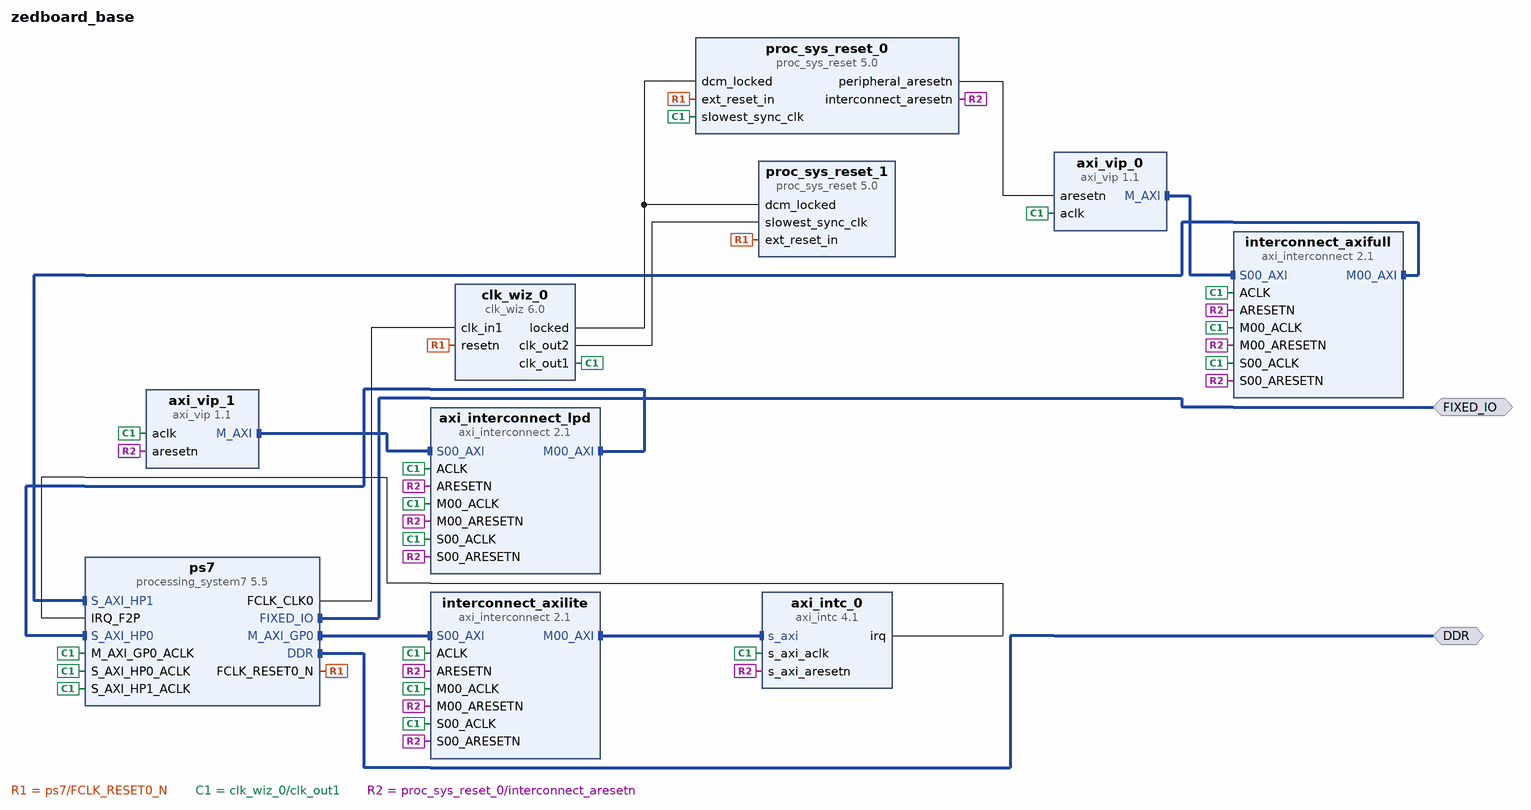
[diagram p0: block diagram of the top level]
# Vivado block design zedboard_base, xc7z020clg484-1, Vivado 2020.2
create_bd_design zedboard_base

create_bd_intf_port -mode Master -vlnv xilinx.com:interface:ddrx_rtl:1.0 DDR
create_bd_intf_port -mode Master -vlnv xilinx.com:display_processing_system7:fixedio_rtl:1.0 FIXED_IO

create_bd_cell -type ip -vlnv xilinx.com:ip:axi_intc:4.1 axi_intc_0
set_property -dict {CONFIG.C_ASYNC_INTR 0xFFFFFFFF CONFIG.C_IRQ_CONNECTION 1 CONFIG.C_IRQ_IS_LEVEL 1} [get_bd_cells axi_intc_0]
create_bd_cell -type ip -vlnv xilinx.com:ip:axi_interconnect:2.1 axi_interconnect_lpd
set_property -dict {CONFIG.NUM_MI 1} [get_bd_cells axi_interconnect_lpd]
create_bd_cell -type ip -vlnv xilinx.com:ip:axi_vip:1.1 axi_vip_0
set_property -dict [list \
  CONFIG.ADDR_WIDTH 32 \
  CONFIG.ARUSER_WIDTH 0 \
  CONFIG.AWUSER_WIDTH 0 \
  CONFIG.BUSER_WIDTH 0 \
  CONFIG.DATA_WIDTH 32 \
  CONFIG.HAS_BRESP 1 \
  CONFIG.HAS_BURST 1 \
  CONFIG.HAS_CACHE 1 \
  CONFIG.HAS_LOCK 1 \
  CONFIG.HAS_PROT 1 \
  CONFIG.HAS_QOS 1 \
  CONFIG.HAS_REGION 1 \
  CONFIG.HAS_RRESP 1 \
  CONFIG.HAS_WSTRB 1 \
  CONFIG.ID_WIDTH 0 \
  CONFIG.INTERFACE_MODE MASTER \
  CONFIG.PROTOCOL AXI4 \
  CONFIG.READ_WRITE_MODE READ_WRITE \
  CONFIG.RUSER_BITS_PER_BYTE 0 \
  CONFIG.RUSER_WIDTH 0 \
  CONFIG.SUPPORTS_NARROW 1 \
  CONFIG.WUSER_BITS_PER_BYTE 0 \
  CONFIG.WUSER_WIDTH 0 \
] [get_bd_cells axi_vip_0]
create_bd_cell -type ip -vlnv xilinx.com:ip:axi_vip:1.1 axi_vip_1
set_property -dict [list \
  CONFIG.ADDR_WIDTH 32 \
  CONFIG.ARUSER_WIDTH 0 \
  CONFIG.AWUSER_WIDTH 0 \
  CONFIG.BUSER_WIDTH 0 \
  CONFIG.DATA_WIDTH 32 \
  CONFIG.HAS_BRESP 1 \
  CONFIG.HAS_BURST 1 \
  CONFIG.HAS_CACHE 1 \
  CONFIG.HAS_LOCK 1 \
  CONFIG.HAS_PROT 1 \
  CONFIG.HAS_QOS 1 \
  CONFIG.HAS_REGION 1 \
  CONFIG.HAS_RRESP 1 \
  CONFIG.HAS_WSTRB 1 \
  CONFIG.ID_WIDTH 0 \
  CONFIG.INTERFACE_MODE MASTER \
  CONFIG.PROTOCOL AXI4 \
  CONFIG.READ_WRITE_MODE READ_WRITE \
  CONFIG.RUSER_BITS_PER_BYTE 0 \
  CONFIG.RUSER_WIDTH 0 \
  CONFIG.SUPPORTS_NARROW 1 \
  CONFIG.WUSER_BITS_PER_BYTE 0 \
  CONFIG.WUSER_WIDTH 0 \
] [get_bd_cells axi_vip_1]
create_bd_cell -type ip -vlnv xilinx.com:ip:clk_wiz:6.0 clk_wiz_0
set_property -dict [list \
  CONFIG.CLKOUT1_JITTER 144.067 \
  CONFIG.CLKOUT1_PHASE_ERROR 156.412 \
  CONFIG.CLKOUT1_REQUESTED_OUT_FREQ 100 \
  CONFIG.CLKOUT2_JITTER 136.006 \
  CONFIG.CLKOUT2_PHASE_ERROR 156.412 \
  CONFIG.CLKOUT2_REQUESTED_OUT_FREQ 142 \
  CONFIG.CLKOUT2_USED true \
  CONFIG.CLKOUT3_REQUESTED_OUT_FREQ 100.000 \
  CONFIG.CLKOUT3_USED false \
  CONFIG.CLKOUT4_REQUESTED_OUT_FREQ 100.000 \
  CONFIG.CLKOUT4_USED false \
  CONFIG.CLKOUT5_REQUESTED_OUT_FREQ 100.000 \
  CONFIG.CLKOUT5_USED false \
  CONFIG.CLKOUT6_REQUESTED_OUT_FREQ 100.000 \
  CONFIG.CLKOUT6_USED false \
  CONFIG.MMCM_CLKFBOUT_MULT_F 11.375 \
  CONFIG.MMCM_CLKOUT0_DIVIDE_F 11.375 \
  CONFIG.MMCM_CLKOUT1_DIVIDE 8 \
  CONFIG.MMCM_CLKOUT2_DIVIDE 1 \
  CONFIG.MMCM_CLKOUT3_DIVIDE 1 \
  CONFIG.MMCM_CLKOUT4_DIVIDE 1 \
  CONFIG.MMCM_CLKOUT5_DIVIDE 1 \
  CONFIG.NUM_OUT_CLKS 2 \
  CONFIG.RESET_TYPE ACTIVE_LOW \
] [get_bd_cells clk_wiz_0]
create_bd_cell -type ip -vlnv xilinx.com:ip:axi_interconnect:2.1 interconnect_axifull
set_property -dict {CONFIG.NUM_MI 1} [get_bd_cells interconnect_axifull]
create_bd_cell -type ip -vlnv xilinx.com:ip:axi_interconnect:2.1 interconnect_axilite
set_property -dict {CONFIG.NUM_MI 1} [get_bd_cells interconnect_axilite]
create_bd_cell -type ip -vlnv xilinx.com:ip:proc_sys_reset:5.0 proc_sys_reset_0
create_bd_cell -type ip -vlnv xilinx.com:ip:proc_sys_reset:5.0 proc_sys_reset_1
create_bd_cell -type ip -vlnv xilinx.com:ip:processing_system7:5.5 ps7
set_property -dict [list \
  CONFIG.PCW_APU_PERIPHERAL_FREQMHZ 666.666667 \
  CONFIG.PCW_ENET0_ENET0_IO {MIO 16 .. 27} \
  CONFIG.PCW_ENET0_GRP_MDIO_ENABLE 1 \
  CONFIG.PCW_ENET0_GRP_MDIO_IO {MIO 52 .. 53} \
  CONFIG.PCW_ENET0_PERIPHERAL_ENABLE 1 \
  CONFIG.PCW_ENET0_RESET_ENABLE 0 \
  CONFIG.PCW_ENET_RESET_ENABLE 1 \
  CONFIG.PCW_ENET_RESET_SELECT {Share reset pin} \
  CONFIG.PCW_FPGA0_PERIPHERAL_FREQMHZ 100.000000 \
  CONFIG.PCW_FPGA1_PERIPHERAL_FREQMHZ 150.000000 \
  CONFIG.PCW_FPGA2_PERIPHERAL_FREQMHZ 50.000000 \
  CONFIG.PCW_GPIO_MIO_GPIO_ENABLE 1 \
  CONFIG.PCW_GPIO_MIO_GPIO_IO MIO \
  CONFIG.PCW_I2C_RESET_ENABLE 1 \
  CONFIG.PCW_IRQ_F2P_INTR 1 \
  CONFIG.PCW_PRESET_BANK1_VOLTAGE {LVCMOS 1.8V} \
  CONFIG.PCW_QSPI_GRP_SINGLE_SS_ENABLE 1 \
  CONFIG.PCW_QSPI_GRP_SINGLE_SS_IO {MIO 1 .. 6} \
  CONFIG.PCW_QSPI_PERIPHERAL_ENABLE 1 \
  CONFIG.PCW_QSPI_PERIPHERAL_FREQMHZ 200.000000 \
  CONFIG.PCW_QSPI_QSPI_IO {MIO 1 .. 6} \
  CONFIG.PCW_SD0_GRP_CD_ENABLE 1 \
  CONFIG.PCW_SD0_GRP_CD_IO {MIO 47} \
  CONFIG.PCW_SD0_GRP_WP_ENABLE 1 \
  CONFIG.PCW_SD0_GRP_WP_IO {MIO 46} \
  CONFIG.PCW_SD0_PERIPHERAL_ENABLE 1 \
  CONFIG.PCW_SD0_SD0_IO {MIO 40 .. 45} \
  CONFIG.PCW_SDIO_PERIPHERAL_FREQMHZ 50 \
  CONFIG.PCW_SINGLE_QSPI_DATA_MODE x4 \
  CONFIG.PCW_TTC0_PERIPHERAL_ENABLE 1 \
  CONFIG.PCW_TTC0_TTC0_IO EMIO \
  CONFIG.PCW_UART1_PERIPHERAL_ENABLE 1 \
  CONFIG.PCW_UART1_UART1_IO {MIO 48 .. 49} \
  CONFIG.PCW_UART_PERIPHERAL_FREQMHZ 50 \
  CONFIG.PCW_UIPARAM_DDR_FREQ_MHZ 533.333313 \
  CONFIG.PCW_UIPARAM_DDR_PARTNO {MT41J128M16 HA-15E} \
  CONFIG.PCW_USB0_PERIPHERAL_ENABLE 1 \
  CONFIG.PCW_USB0_RESET_ENABLE 0 \
  CONFIG.PCW_USB0_USB0_IO {MIO 28 .. 39} \
  CONFIG.PCW_USB_RESET_ENABLE 1 \
  CONFIG.PCW_USB_RESET_SELECT {Share reset pin} \
  CONFIG.PCW_USE_FABRIC_INTERRUPT 1 \
  CONFIG.PCW_USE_S_AXI_HP0 1 \
  CONFIG.PCW_USE_S_AXI_HP1 1 \
  CONFIG.preset ZedBoard \
] [get_bd_cells ps7]
# 222 more settings of ps7 are not shown: defaults, MIO pin electricals, DDR timing, and values the tool derives

# ---- connections ----

connect_bd_intf_net [get_bd_intf_ports FIXED_IO] [get_bd_intf_pins ps7/FIXED_IO]
connect_bd_intf_net [get_bd_intf_ports DDR] [get_bd_intf_pins ps7/DDR]
connect_bd_intf_net [get_bd_intf_pins axi_vip_0/M_AXI] [get_bd_intf_pins interconnect_axifull/S00_AXI]
connect_bd_intf_net -intf_net ps_7_M_AXI_HPM0_LPD [get_bd_intf_pins interconnect_axilite/S00_AXI] [get_bd_intf_pins ps7/M_AXI_GP0]
connect_bd_intf_net -intf_net axi_interconnect_0_M00_AXI [get_bd_intf_pins axi_intc_0/s_axi] [get_bd_intf_pins interconnect_axilite/M00_AXI]
connect_bd_intf_net [get_bd_intf_pins axi_interconnect_lpd/S00_AXI] [get_bd_intf_pins axi_vip_1/M_AXI]
connect_bd_intf_net -intf_net axi_interconnect_0_M00_AXI1 [get_bd_intf_pins axi_interconnect_lpd/M00_AXI] [get_bd_intf_pins ps7/S_AXI_HP0]
connect_bd_intf_net -intf_net axi_interconnect_1_M00_AXI [get_bd_intf_pins interconnect_axifull/M00_AXI] [get_bd_intf_pins ps7/S_AXI_HP1]
connect_bd_net [get_bd_pins ps7/FCLK_RESET0_N] \
  [get_bd_pins clk_wiz_0/resetn] [get_bd_pins proc_sys_reset_0/ext_reset_in] [get_bd_pins proc_sys_reset_1/ext_reset_in]
connect_bd_net [get_bd_pins axi_intc_0/irq] [get_bd_pins ps7/IRQ_F2P]
connect_bd_net -net ACLK_1 [get_bd_pins clk_wiz_0/clk_out1] \
  [get_bd_pins axi_interconnect_lpd/ACLK] [get_bd_pins axi_interconnect_lpd/M00_ACLK] \
  [get_bd_pins axi_interconnect_lpd/S00_ACLK] [get_bd_pins axi_vip_0/aclk] [get_bd_pins axi_vip_1/aclk] \
  [get_bd_pins interconnect_axifull/ACLK] [get_bd_pins interconnect_axifull/M00_ACLK] \
  [get_bd_pins interconnect_axifull/S00_ACLK] [get_bd_pins axi_intc_0/s_axi_aclk] [get_bd_pins interconnect_axilite/ACLK] \
  [get_bd_pins interconnect_axilite/M00_ACLK] [get_bd_pins interconnect_axilite/S00_ACLK] [get_bd_pins ps7/S_AXI_HP0_ACLK] \
  [get_bd_pins proc_sys_reset_0/slowest_sync_clk] [get_bd_pins ps7/M_AXI_GP0_ACLK] [get_bd_pins ps7/S_AXI_HP1_ACLK]
connect_bd_net [get_bd_pins clk_wiz_0/clk_out2] [get_bd_pins proc_sys_reset_1/slowest_sync_clk]
connect_bd_net [get_bd_pins clk_wiz_0/locked] [get_bd_pins proc_sys_reset_0/dcm_locked] [get_bd_pins proc_sys_reset_1/dcm_locked]
connect_bd_net [get_bd_pins proc_sys_reset_0/interconnect_aresetn] \
  [get_bd_pins axi_interconnect_lpd/ARESETN] [get_bd_pins axi_interconnect_lpd/M00_ARESETN] \
  [get_bd_pins axi_interconnect_lpd/S00_ARESETN] [get_bd_pins axi_vip_1/aresetn] [get_bd_pins interconnect_axifull/ARESETN] \
  [get_bd_pins interconnect_axifull/M00_ARESETN] [get_bd_pins interconnect_axifull/S00_ARESETN] \
  [get_bd_pins axi_intc_0/s_axi_aresetn] [get_bd_pins interconnect_axilite/ARESETN] \
  [get_bd_pins interconnect_axilite/M00_ARESETN] [get_bd_pins interconnect_axilite/S00_ARESETN]
connect_bd_net [get_bd_pins proc_sys_reset_0/peripheral_aresetn] [get_bd_pins axi_vip_0/aresetn]
connect_bd_net -net ps_7_pl_clk0 [get_bd_pins ps7/FCLK_CLK0] [get_bd_pins clk_wiz_0/clk_in1]
set_property PFM.IRQ {intr {id 0 range 32}} [get_bd_cells axi_intc_0]
set_property PFM.AXI_PORT {S01_AXI {memport "S_AXI_HP" sptag "" memory ""} S02_AXI {memport "S_AXI_HP" sptag "" memory ""} S03_AXI {memport "S_AXI_HP" sptag "" memory ""} S04_AXI {memport "S_AXI_HP" sptag "" memory ""} S05_AXI {memport "S_AXI_HP" sptag "" memory ""} S06_AXI {memport "S_AXI_HP" sptag "" memory ""} S07_AXI {memport "S_AXI_HP" sptag "" memory ""} S08_AXI {memport "S_AXI_HP" sptag "" memory ""} S09_AXI {memport "S_AXI_HP" sptag "" memory ""} S10_AXI {memport "S_AXI_HP" sptag "" memory ""} S11_AXI {memport "S_AXI_HP" sptag "" memory ""} S12_AXI {memport "S_AXI_HP" sptag "" memory ""} S13_AXI {memport "S_AXI_HP" sptag "" memory ""} S14_AXI {memport "S_AXI_HP" sptag "" memory ""} S15_AXI {memport "S_AXI_HP" sptag "" memory ""}} [get_bd_cells axi_interconnect_lpd]
set_property PFM.CLOCK {clk_out1 {id "0" is_default "true" proc_sys_reset "proc_sys_reset_0" status "fixed"} clk_out2 {id "1" is_default "false" proc_sys_reset "proc_sys_reset_1" status "fixed"}} [get_bd_cells clk_wiz_0]
set_property HDL_ATTRIBUTE.DPA_TRACE_SLAVE true [get_bd_cells interconnect_axifull]
set_property PFM.AXI_PORT {S01_AXI {memport "S_AXI_HP" sptag "HP0" memory ""} S02_AXI {memport "S_AXI_HP" sptag "HP0" memory ""} S03_AXI {memport "S_AXI_HP" sptag "HP0" memory ""} S04_AXI {memport "S_AXI_HP" sptag "HP0" memory ""} S05_AXI {memport "S_AXI_HP" sptag "HP0" memory ""} S06_AXI {memport "S_AXI_HP" sptag "HP0" memory ""} S07_AXI {memport "S_AXI_HP" sptag "HP0" memory ""} S08_AXI {memport "S_AXI_HP" sptag "HP0" memory ""} S09_AXI {memport "S_AXI_HP" sptag "HP0" memory ""} S10_AXI {memport "S_AXI_HP" sptag "HP0" memory ""} S11_AXI {memport "S_AXI_HP" sptag "HP0" memory ""} S12_AXI {memport "S_AXI_HP" sptag "HP0" memory ""} S13_AXI {memport "S_AXI_HP" sptag "HP0" memory ""} S14_AXI {memport "S_AXI_HP" sptag "HP0" memory ""} S15_AXI {memport "S_AXI_HP" sptag "HP0" memory ""}} [get_bd_cells interconnect_axifull]
set_property HDL_ATTRIBUTE.DPA_AXILITE_MASTER fallback [get_bd_cells interconnect_axilite]
set_property PFM.AXI_PORT {M01_AXI {memport "M_AXI_GP"} M02_AXI {memport "M_AXI_GP"} M03_AXI {memport "M_AXI_GP"} M04_AXI {memport "M_AXI_GP"} M05_AXI {memport "M_AXI_GP"} M06_AXI {memport "M_AXI_GP"} M07_AXI {memport "M_AXI_GP"} M08_AXI {memport "M_AXI_GP"} M09_AXI {memport "M_AXI_GP"} M10_AXI {memport "M_AXI_GP"} M11_AXI {memport "M_AXI_GP"} M12_AXI {memport "M_AXI_GP"} M13_AXI {memport "M_AXI_GP"} M14_AXI {memport "M_AXI_GP"} M15_AXI {memport "M_AXI_GP"} M16_AXI {memport "M_AXI_GP"} M17_AXI {memport "M_AXI_GP"} M18_AXI {memport "M_AXI_GP"} M19_AXI {memport "M_AXI_GP"} M20_AXI {memport "M_AXI_GP"} M21_AXI {memport "M_AXI_GP"} M22_AXI {memport "M_AXI_GP"} M23_AXI {memport "M_AXI_GP"} M24_AXI {memport "M_AXI_GP"} M25_AXI {memport "M_AXI_GP"} M26_AXI {memport "M_AXI_GP"} M27_AXI {memport "M_AXI_GP"} M28_AXI {memport "M_AXI_GP"} M29_AXI {memport "M_AXI_GP"} M30_AXI {memport "M_AXI_GP"} M31_AXI {memport "M_AXI_GP"} M32_AXI {memport "M_AXI_GP"} M33_AXI {memport "M_AXI_GP"} M34_AXI {memport "M_AXI_GP"} M35_AXI {memport "M_AXI_GP"} M36_AXI {memport "M_AXI_GP"} M37_AXI {memport "M_AXI_GP"} M38_AXI {memport "M_AXI_GP"} M39_AXI {memport "M_AXI_GP"} M40_AXI {memport "M_AXI_GP"} M41_AXI {memport "M_AXI_GP"} M42_AXI {memport "M_AXI_GP"} M43_AXI {memport "M_AXI_GP"} M44_AXI {memport "M_AXI_GP"} M45_AXI {memport "M_AXI_GP"} M46_AXI {memport "M_AXI_GP"} M47_AXI {memport "M_AXI_GP"} M48_AXI {memport "M_AXI_GP"} M49_AXI {memport "M_AXI_GP"} M50_AXI {memport "M_AXI_GP"} M51_AXI {memport "M_AXI_GP"} M52_AXI {memport "M_AXI_GP"} M53_AXI {memport "M_AXI_GP"} M54_AXI {memport "M_AXI_GP"} M55_AXI {memport "M_AXI_GP"} M56_AXI {memport "M_AXI_GP"} M57_AXI {memport "M_AXI_GP"} M58_AXI {memport "M_AXI_GP"} M59_AXI {memport "M_AXI_GP"} M60_AXI {memport "M_AXI_GP"} M61_AXI {memport "M_AXI_GP"} M62_AXI {memport "M_AXI_GP"} M63_AXI {memport "M_AXI_GP"}} [get_bd_cells interconnect_axilite]
set_property PFM.AXI_PORT {M_AXI_GP1 {memport "M_AXI_GP" sptag "" memory "" is_range "false"} S_AXI_HP2 {memport "S_AXI_HP" sptag "HP2" memory "" is_range "false"} S_AXI_HP3 {memport "S_AXI_HP" sptag "HP3" memory "" is_range "false"}} [get_bd_cells ps7]

# ---- address map ----
assign_bd_address -offset 0x00000000 -range 512M -target_address_space [get_bd_addr_spaces axi_vip_0/Master_AXI] [get_bd_addr_segs ps7/S_AXI_HP1/HP1_DDR_LOWOCM]
assign_bd_address -offset 0x00000000 -range 512M -target_address_space [get_bd_addr_spaces axi_vip_1/Master_AXI] [get_bd_addr_segs ps7/S_AXI_HP0/HP0_DDR_LOWOCM]
assign_bd_address -offset 0x41800000 -range 64K -target_address_space [get_bd_addr_spaces ps7/Data] [get_bd_addr_segs axi_intc_0/S_AXI/Reg]

validate_bd_design
save_bd_design
